# Altium schematic sheet main.SchDoc
size A4; SheetNumber: 1; SheetTotal: 4
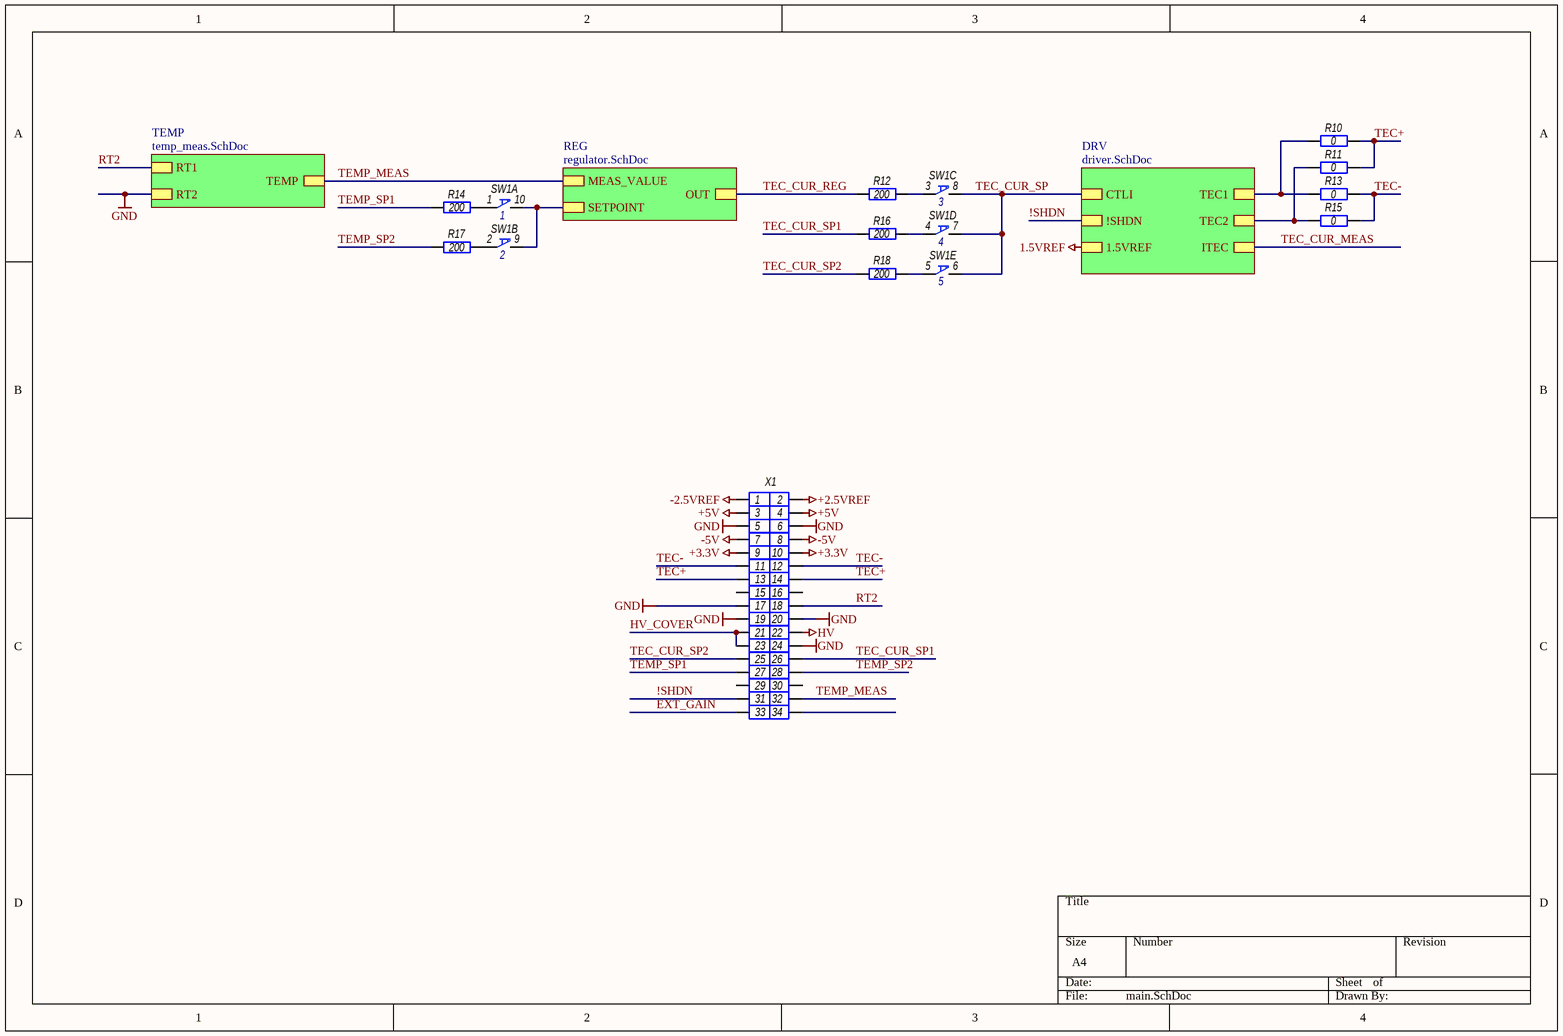
[diagram p0: main.SchDoc]

## Parts
R10  0  [RES_0805]
R11  0  [RES_0805]
R12  200  [RES_0603]
R13  0  [RES_0805]
R14  200  [RES_0603]
R15  0  [RES_0805]
R16  200  [RES_0603]
R17  200  [RES_0603]
R18  200  [RES_0603]
SW1  ?  [SWD1-5]  (value not drawn)  (parts A,B,C,D,E of 5)
X1  ?  [BH-34]  (value not drawn)

## Sub-sheets
DRV = driver.SchDoc: TEC1, 1.5VREF, !SHDN, ITEC, CTLI, TEC2
REG = regulator.SchDoc: SETPOINT, MEAS_VALUE, OUT
TEMP = temp_meas.SchDoc: RT2, TEMP, RT1

## Nets
1.5VREF: sheet DRV/1.5VREF
+2.5VREF: X1.2
+3.3V: X1.9 X1.10
+5V: X1.3 X1.4
-2.5VREF: X1.1
-5V: X1.7 X1.8
GND: X1.5 X1.6 X1.17 X1.19 X1.20 X1.24 ; sheet TEMP/RT2
HV: X1.22
!SHDN: X1.31 ; sheet DRV/!SHDN
EXT_GAIN: X1.33
HV_COVER: X1.21 X1.23
RT2: X1.18 ; sheet TEMP/RT1
TEC+: R10.2 R11.2 X1.13 X1.14
TEC-: R13.2 R15.2 X1.11 X1.12
TEC_CUR_MEAS: sheet DRV/ITEC
TEC_CUR_REG: R12.1 ; sheet REG/OUT
TEC_CUR_SP: SW1.6 SW1.7 SW1.8 ; sheet DRV/CTLI
TEC_CUR_SP1: R16.1 X1.26
TEC_CUR_SP2: R18.1 X1.25
TEMP_MEAS: X1.32 ; sheet TEMP/TEMP, sheet REG/MEAS_VALUE
TEMP_SP1: R14.1 X1.27
TEMP_SP2: R17.1 X1.28
NetR10_1: R10.1 R13.1 ; sheet DRV/TEC1
NetR11_1: R11.1 R15.1 ; sheet DRV/TEC2
NetR12_2: R12.2 SW1.3
NetR14_2: R14.2 SW1.1
NetR16_2: R16.2 SW1.4
NetR17_2: R17.2 SW1.2
NetR18_2: R18.2 SW1.5
NetSW1_9: SW1.9 SW1.10 ; sheet REG/SETPOINT

Not connected (* = marked no-connect by the designer): X1 15 16 29 30 34

## Library data of the parts
R10-R18 = Resisitor: Резистор; ValueBOM: 0805 10k 0.125; ValueSCH: 10k; MarkPCB: 103
SW1 = SWD1-5: Переключатель 2 группы прямой: / SWD1-5; / DS1040-05RN; / DS1040-05BN; / BD05
X1 = Connector 17x2: ValueSCH: Model